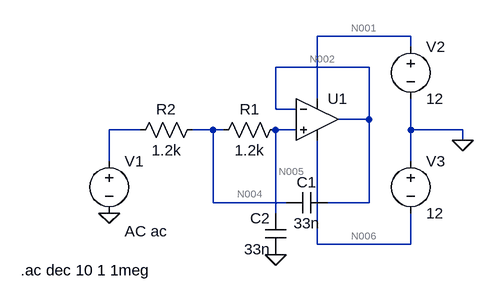
[diagram p0: schematic Exp1_bodeplot.asc]
Exp1_bodeplot.asc, the LTspice schematic file:
Version 4
SHEET 1 880 680
WIRE 432 16 288 16
WIRE 432 32 432 16
WIRE 368 64 224 64
WIRE 288 112 288 16
WIRE 224 128 224 64
WIRE 256 128 224 128
WIRE 368 144 368 64
WIRE 368 144 320 144
WIRE 16 160 -32 160
WIRE 128 160 96 160
WIRE 144 160 128 160
WIRE 256 160 224 160
WIRE 432 160 432 112
WIRE 512 160 432 160
WIRE 512 176 512 160
WIRE -32 208 -32 160
WIRE 432 208 432 160
WIRE 128 272 128 160
WIRE 240 272 128 272
WIRE 368 272 368 144
WIRE 368 272 304 272
WIRE 224 288 224 160
WIRE 288 336 288 176
WIRE 432 336 432 288
WIRE 432 336 288 336
FLAG -32 288 0
FLAG 224 352 0
FLAG 512 176 0
SYMBOL OpAmps\\UniversalOpAmp 288 144 R0
SYMATTR InstName U1
SYMBOL res 240 144 R90
WINDOW 0 0 56 VBottom 2
WINDOW 3 32 56 VTop 2
SYMATTR InstName R1
SYMATTR Value 1.2k
SYMBOL res 112 144 R90
WINDOW 0 0 56 VBottom 2
WINDOW 3 32 56 VTop 2
SYMATTR InstName R2
SYMATTR Value 1.2k
SYMBOL voltage -32 192 R0
WINDOW 123 24 124 Left 2
WINDOW 39 0 0 Left 0
SYMATTR InstName V1
SYMATTR Value ""
SYMATTR Value2 AC ac
SYMBOL voltage 432 16 R0
WINDOW 123 0 0 Left 0
WINDOW 39 0 0 Left 0
SYMATTR InstName V2
SYMATTR Value 12
SYMBOL voltage 432 192 R0
WINDOW 123 0 0 Left 0
WINDOW 39 0 0 Left 0
SYMATTR InstName V3
SYMATTR Value 12
SYMBOL cap 304 256 R90
WINDOW 0 0 32 VBottom 2
WINDOW 3 32 32 VTop 2
SYMATTR InstName C1
SYMATTR Value 33n
SYMBOL cap 240 352 R180
WINDOW 0 24 56 Left 2
WINDOW 3 24 8 Left 2
SYMATTR InstName C2
SYMATTR Value 33n
TEXT -168 376 Left 2 !.ac dec 10 1 1meg

The netlist it stands for:
* Exp1_bodeplot.asc
XU1 N005 N002 N001 N006 N002 level1 Avol=1Meg GBW=10Meg Vos=0 En=0 Enk=0 In=0 Ink=0 Rin=500Meg  ; pins In+ In- V+ V- OUT
R1 N005 N004 1.2k
R2 N004 N003 1.2k
V1 N003 0 AC ac
V2 N001 0 12
V3 0 N006 12
C1 N002 N004 33n
C2 0 N005 33n
.ac dec 10 1 1meg
.lib UniversalOpAmp1.lib
.backanno
.end

* Results of the author's LTspice run, read from the files saved beside the schematic
* Operating Point, zero values left out:
*   V(n001) = 12 V
*   V(n006) = -12 V
*   I(V2) = -24 nA
*   I(V3) = -24 nA
*   Ix(u1:3) = 24 nA
*   Ix(u1:4) = -24 nA
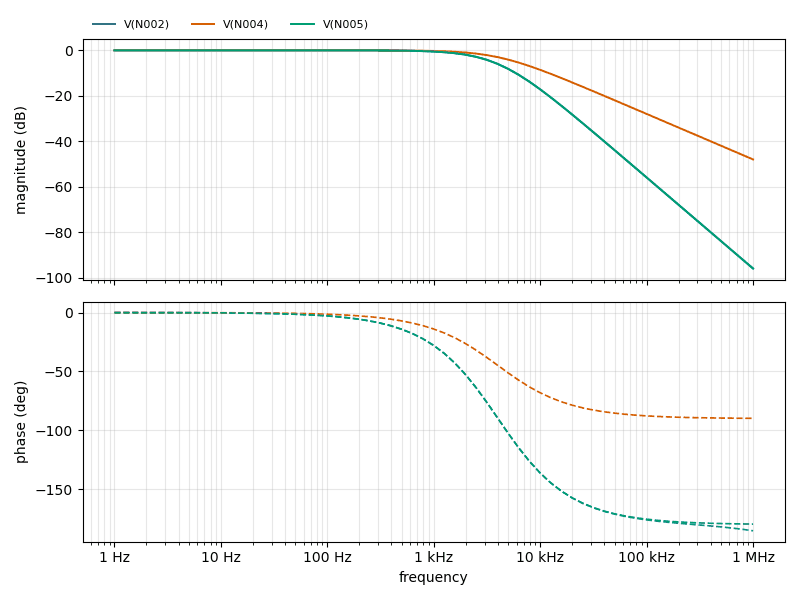
[diagram p1: AC Analysis of Exp1_bodeplot.asc, plotted from the saved traces]
* AC Analysis, 1 run:
*   V(N002): -0.00 dB at 1 Hz, -95.88 dB at 1 MHz, peak -0.00 dB at 1 Hz, 3 dB below the peak at 2.577 kHz
*   V(N004): -0.00 dB at 1 Hz, -47.92 dB at 1 MHz, peak -0.00 dB at 1 Hz, 3 dB below the peak at 4.015 kHz
*   V(N005): -0.00 dB at 1 Hz, -95.84 dB at 1 MHz, peak -0.00 dB at 1 Hz, 3 dB below the peak at 2.577 kHz